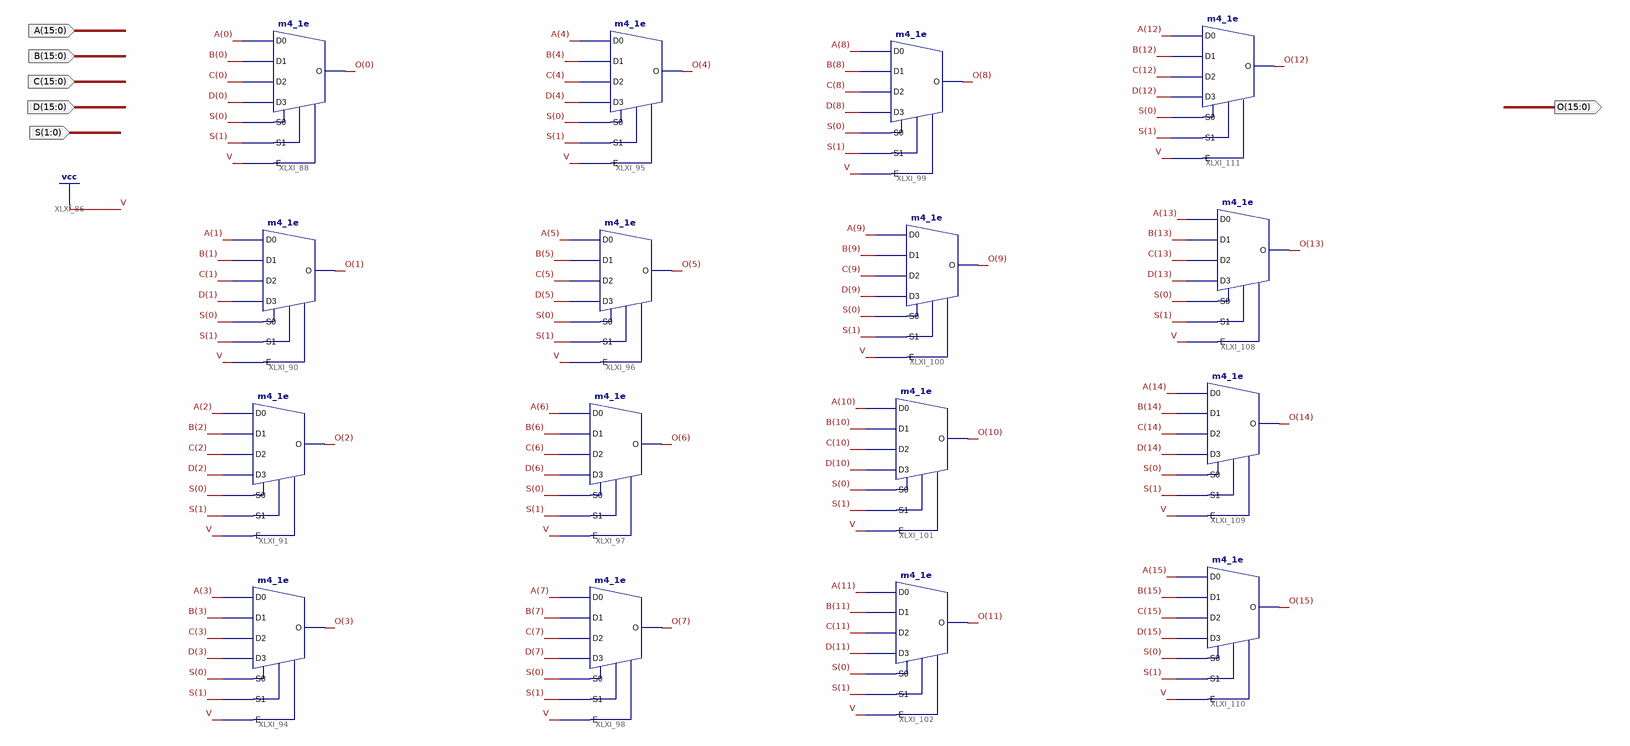
[diagram p0: schematic sheet 1]
// Xilinx ISE schematic mux16b4.sch (spartan3e) as structural Verilog: 16 symbols, 6 ports
module mux16b4 (
  input  [15:0] A,
  input  [15:0] B,
  input  [15:0] C,
  input  [15:0] D,
  input  [1:0] S,
  output [15:0] O
);

  m4_1e XLXI_88 (.D0(A[0]), .D1(B[0]), .D2(C[0]), .D3(D[0]), .E(1'b1), .S0(S[0]), .S1(S[1]), .O(O[0]));
  m4_1e XLXI_90 (.D0(A[1]), .D1(B[1]), .D2(C[1]), .D3(D[1]), .E(1'b1), .S0(S[0]), .S1(S[1]), .O(O[1]));
  m4_1e XLXI_91 (.D0(A[2]), .D1(B[2]), .D2(C[2]), .D3(D[2]), .E(1'b1), .S0(S[0]), .S1(S[1]), .O(O[2]));
  m4_1e XLXI_94 (.D0(A[3]), .D1(B[3]), .D2(C[3]), .D3(D[3]), .E(1'b1), .S0(S[0]), .S1(S[1]), .O(O[3]));
  m4_1e XLXI_95 (.D0(A[4]), .D1(B[4]), .D2(C[4]), .D3(D[4]), .E(1'b1), .S0(S[0]), .S1(S[1]), .O(O[4]));
  m4_1e XLXI_96 (.D0(A[5]), .D1(B[5]), .D2(C[5]), .D3(D[5]), .E(1'b1), .S0(S[0]), .S1(S[1]), .O(O[5]));
  m4_1e XLXI_97 (.D0(A[6]), .D1(B[6]), .D2(C[6]), .D3(D[6]), .E(1'b1), .S0(S[0]), .S1(S[1]), .O(O[6]));
  m4_1e XLXI_98 (.D0(A[7]), .D1(B[7]), .D2(C[7]), .D3(D[7]), .E(1'b1), .S0(S[0]), .S1(S[1]), .O(O[7]));
  m4_1e XLXI_100 (.D0(A[9]), .D1(B[9]), .D2(C[9]), .D3(D[9]), .E(1'b1), .S0(S[0]), .S1(S[1]), .O(O[9]));
  m4_1e XLXI_101 (.D0(A[10]), .D1(B[10]), .D2(C[10]), .D3(D[10]), .E(1'b1), .S0(S[0]), .S1(S[1]), .O(O[10]));
  m4_1e XLXI_102 (.D0(A[11]), .D1(B[11]), .D2(C[11]), .D3(D[11]), .E(1'b1), .S0(S[0]), .S1(S[1]), .O(O[11]));
  m4_1e XLXI_99 (.D0(A[8]), .D1(B[8]), .D2(C[8]), .D3(D[8]), .E(1'b1), .S0(S[0]), .S1(S[1]), .O(O[8]));
  m4_1e XLXI_108 (.D0(A[13]), .D1(B[13]), .D2(C[13]), .D3(D[13]), .E(1'b1), .S0(S[0]), .S1(S[1]), .O(O[13]));
  m4_1e XLXI_109 (.D0(A[14]), .D1(B[14]), .D2(C[14]), .D3(D[14]), .E(1'b1), .S0(S[0]), .S1(S[1]), .O(O[14]));
  m4_1e XLXI_110 (.D0(A[15]), .D1(B[15]), .D2(C[15]), .D3(D[15]), .E(1'b1), .S0(S[0]), .S1(S[1]), .O(O[15]));
  m4_1e XLXI_111 (.D0(A[12]), .D1(B[12]), .D2(C[12]), .D3(D[12]), .E(1'b1), .S0(S[0]), .S1(S[1]), .O(O[12]));
endmodule
